# Altium schematic sheet MTCH9010_Evaluation_Kit_Power_USB_Bridge.SchDoc
size A3; SheetTitle: USB Bridge and Power Supply; CompanyName: Microchip Technology Inc.; Organization: Microchip Technology; Address1: 2355 West Chandler Blvd.; Address2: Chandler, AZ  85224; Address4: USA; SheetNumber: 3; SheetTotal: 4; Time: Time
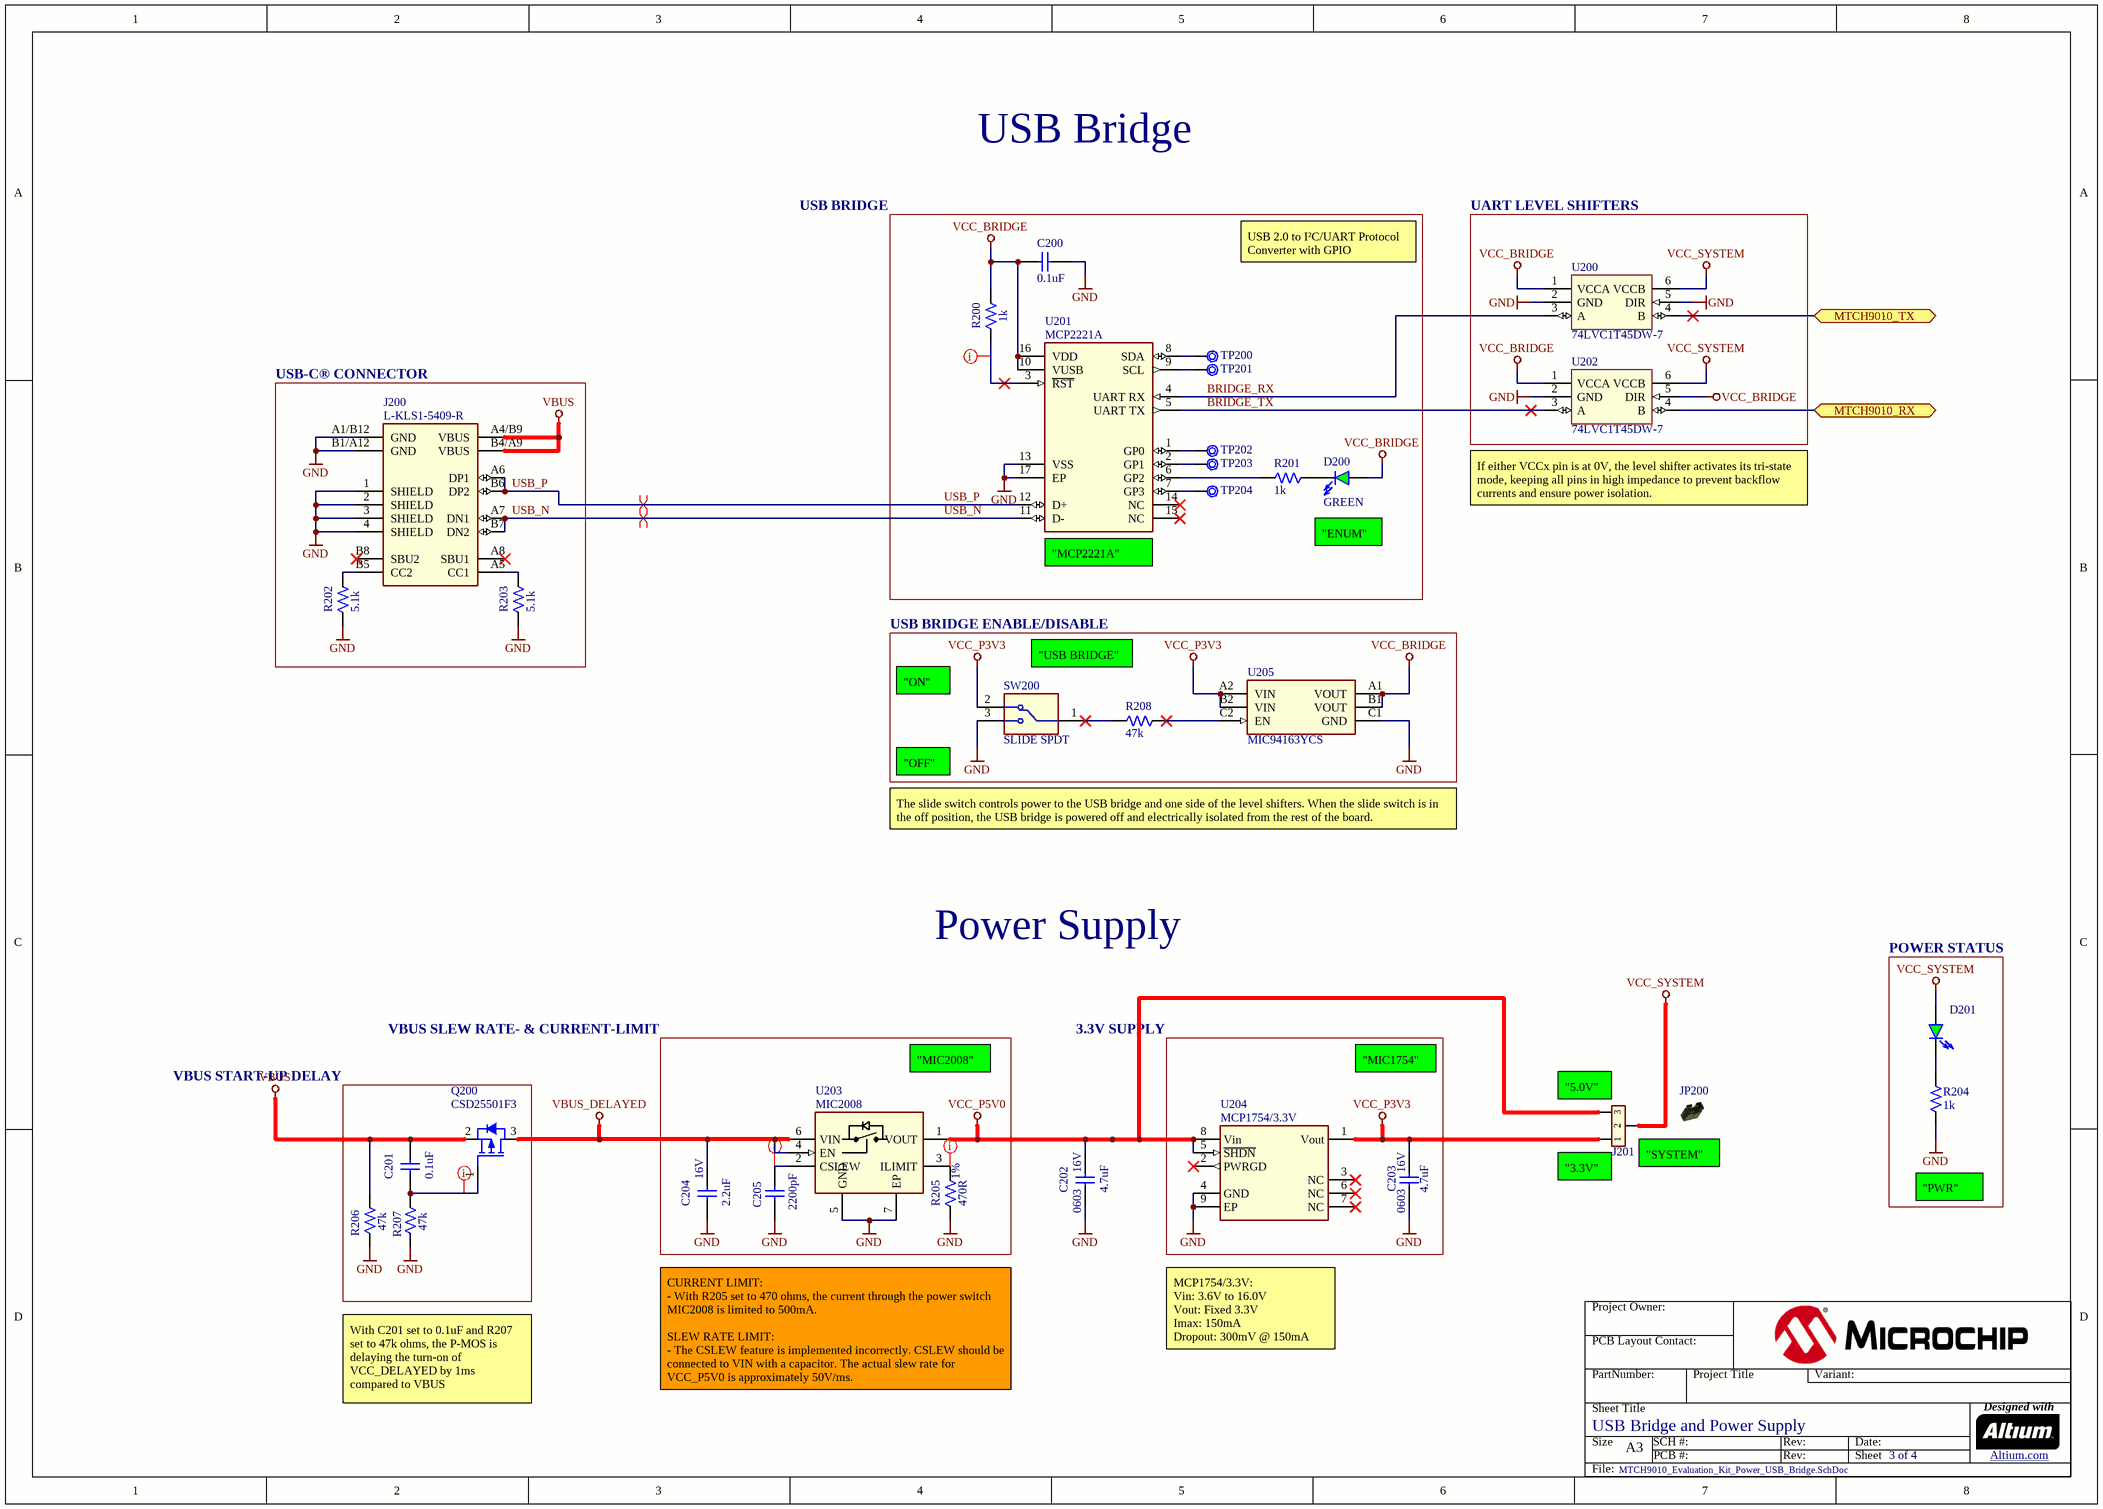
[diagram p0: MTCH9010_Evaluation_Kit_Power_USB_Bridge.SchDoc]

## Parts
C200  value 0.1uF  [CAP_C_0402]  (hidden comment: Capacitor NP)
C201  value 0.1uF  [CAP_C_0402]  (hidden comment: Capacitor NP)
C202  value 4.7uF  Voltage: 16V  Package: 0603  [CAP_C_0603]  (hidden comment: Capacitor NP)
C203  value 4.7uF  Voltage: 16V  Package: 0603  [CAP_C_0603]  (hidden comment: Capacitor NP)
C204  value 2.2uF  Voltage: 16V  [CAP_C_0402]  (hidden comment: Capacitor NP)
C205  value 2200pF  [CAP_C_0402]  (hidden comment: Capacitor NP)
D200  value GREEN  [LED_0603_Green]  (hidden comment: LED_green)
D201  LED_green  [LED_0603_Green]  (value not drawn)
J200  Manufacturer Part Number 1: L-KLS1-5409-R  [CON_USB2.0-C_RCPT_SMD_RA_KLS_KLS1-5409]  (hidden comment: CON USB2.0-C RCPT SMD RA KLS KLS1-5409)
J201  Header 1x3  [HDR_M_2.54_1X2_U_TH-PIP_RA_WCON_1125-1103S0R140CR01]  (value not drawn)
JP200  Jumper Mechanical  [Jumper_Mechanical]  (value not drawn)
Q200  value CSD25501F3  [LGA-3_GSD_0.7x0.6_CSD25501F3]  (hidden comment: Transistor MOS-P GSD)
R200  value 1k  [RES_C_0402]  (hidden comment: Resistor)
R201  value 1k  [RES_C_0402]  (hidden comment: Resistor)
R202  value 5.1k  [RES_C_0402]  (hidden comment: Resistor)
R203  value 5.1k  [RES_C_0402]  (hidden comment: Resistor)
R204  value 1k  [RES_C_0402]  (hidden comment: Resistor)
R205  value 470R  Tolerance: 1%  [RES_C_0402]  (hidden comment: Resistor)
R206  value 47k  [RES_C_0402]  (hidden comment: Resistor)
R207  value 47k  [RES_C_0402]  (hidden comment: Resistor)
R208  value 47k  [RES_C_0402]  (hidden comment: Resistor)
SW200  value SLIDE SPDT  [SW_SLIDE_SMD_SS_SLW-88229-2-SMT-TR]  (hidden comment: SWITCH SLIDE SMD SPDT SLW-88229-2-SMT-TR)
TP200  Test Point No BOM  [CON_TP_0.8dia_SMD_with_Test_Jig_Layer]  (value not drawn)  (no BOM)
TP201  Test Point No BOM  [CON_TP_0.8dia_SMD_with_Test_Jig_Layer]  (value not drawn)  (no BOM)
TP202  Test Point No BOM  [CON_TP_0.8dia_SMD_with_Test_Jig_Layer]  (value not drawn)  (no BOM)
TP203  Test Point No BOM  [CON_TP_0.8dia_SMD_with_Test_Jig_Layer]  (value not drawn)  (no BOM)
TP204  Test Point No BOM  [CON_TP_0.8dia_SMD_with_Test_Jig_Layer]  (value not drawn)  (no BOM)
U200  value 74LVC1T45DW-7  [SOT-363]  (hidden comment: 74LVC(H)1T45 SOT-23-6_SC-70-6_SOT-6_SOT-363_DSBGA)
U201  value MCP2221A  [QFN-16_4X4_EP2.5X2.5]  (hidden comment: MCP2221 QFN-16)
U202  value 74LVC1T45DW-7  [SOT-363]  (hidden comment: 74LVC(H)1T45 SOT-23-6_SC-70-6_SOT-6_SOT-363_DSBGA)
U203  value MIC2008  [VDFN-6_2x2_EP0.8X1.40]  (hidden comment: MIC2008YML-TR VDFN-6)
U204  value MCP1754/3.3V  [DFN-8_2x3]  (hidden comment: MCP1755 DFN-8)
U205  value MIC94163YCS  [MIC94163_1.5MM_1MM]  (hidden comment: MIC94163_1.5MM_1MM)

## Blocks framed on the sheet
USB BRIDGE: C200 D200 R200 R201 TP200-TP204 U201
UART LEVEL SHIFTERS: U200 U202
USB-C® CONNECTOR: J200 R202 R203
USB BRIDGE ENABLE/DISABLE: R208 SW200 U205
POWER STATUS: D201 R204
VBUS SLEW RATE- & CURRENT-LIMIT: C204 C205 R205 U203
3.3V SUPPLY: C203 U204
VBUS START-UP DELAY: C201 Q200 R206 R207

## Ports
MTCH9010_RX (bidir), MTCH9010_TX (bidir)

## Nets
GND: C200.2 C202.1 C203.1 C204.1 C205.1 J200.1(SHIELD) J200.2(SHIELD) J200.3(SHIELD) J200.4(SHIELD) J200.A1/B12(GND) J200.B1/A12(GND) R202.2 R203.2 R204.1 R205.1 R206.2 R207.2 SW200.3 U200.2(GND) U200.5(DIR) U201.13(VSS) U201.17(EP) U202.2(GND) U203.5(GND) U203.7(EP) U204.4(GND) U204.9(EP) U205.C1(GND)
VBUS: C201.2 J200.A4/B9(VBUS) J200.B4/A9(VBUS) Q200.2(S) R206.1
VBUS_DELAYED: C204.2 Q200.3(D) U203.4(EN) U203.6(VIN)
VCC_BRIDGE: C200.1 D200.1(A) R200.2 U200.1(VCCA) U201.10(VUSB) U201.16(VDD) U202.1(VCCA) U202.5(DIR) U205.A1(VOUT) U205.B1(VOUT)
VCC_P3V3: C203.2 J201.1 SW200.2 U204.1(Vout) U205.A2(VIN) U205.B2(VIN)
VCC_P5V0: C202.2 J201.3 U203.1(VOUT) U204.5(~{SHDN}) U204.8(Vin)
VCC_SYSTEM: D201.1(A) J201.2 U200.6(VCCB) U202.6(VCCB)
BRIDGE_RX: U200.3(A) U201.4(UART_RX)
BRIDGE_TX: U201.5(UART_TX) U202.3(A)
MTCH9010_RX: U202.4(B) ; port MTCH9010_RX
MTCH9010_TX: U200.4(B) ; port MTCH9010_TX
USB_N: J200.A7(DN1) J200.B7(DN2) U201.11(D-)
USB_P: J200.A6(DP1) J200.B6(DP2) U201.12(D+)
NetC201_1: C201.1 Q200.1(G) R207.1
NetC205_2: C205.2 U203.2(CSLEW)
NetD200_2: D200.2(K) R201.1
NetD201_2: D201.2(K) R204.2
NetJ200_A5: J200.A5(CC1) R203.1
NetJ200_B5: J200.B5(CC2) R202.1
NetR200_1: R200.1 U201.3(~{RST})
NetR201_2: R201.2 U201.6(GP2)
NetR205_2: R205.2 U203.3(ILIMIT)
NetR208_1: R208.1 SW200.1
NetR208_2: R208.2 U205.C2(EN)
NetTP200_1: TP200.1 U201.8(SDA)
NetTP201_1: TP201.1 U201.9(SCL)
NetTP202_1: TP202.1 U201.1(GP0)
NetTP203_1: TP203.1 U201.2(GP1)
NetTP204_1: TP204.1 U201.7(GP3)

Not connected (* = marked no-connect by the designer): J200 A8(SBU1)* B8(SBU2)*; U201 14(NC)* 15(NC)*; U204 2(PWRGD)* 3(NC)* 6(NC)* 7(NC)*

## Layout directives
differential pair; net class NO TESTPOINT: USB_N, USB_P
net class NO TESTPOINT: NetC201_1, NetC205_2, NetR200_1, NetR205_2

## Notes on the sheet
- USB Bridge
- USB 2.0 to I²C/UART Protocol Converter with GPIO
- (near U202) If either VCCx pin is at 0V, the level shifter activates its tri-state mode, keeping all pins in high impedance to prevent backflow currents and ensure power isolation.
- (near U201) "MCP2221A"
- "ENUM"
- "ON"
- "USB BRIDGE"
- "OFF"
- The slide switch controls power to the USB bridge and one side of the level shifters. When the slide switch is in the off position, the USB bridge is powered off and electrically isolated from the rest of the board.
- Power Supply
- "MIC2008"
- "MIC1754"
- (near J201) "5.0V"
- (near J201) "3.3V"
- (near J201) "SYSTEM"
- "PWR"
- With C201 set to 0.1uF and R207 set to 47k ohms, the P-MOS is delaying the turn-on of VCC_DELAYED by 1ms compared to VBUS
- CURRENT LIMIT:
  - With R205 set to 470 ohms, the current through the power switch MIC2008 is limited to 500mA.
  SLEW RATE LIMIT:
  - The CSLEW feature is implemented incorrectly. CSLEW should be connected to VIN with a capacitor. The actual slew rate for VCC_P5V0 is approximately 50V/ms.
- MCP1754/3.3V:
  Vin: 3.6V to 16.0V
  Vout: Fixed 3.3V
  Imax: 150mA
  Dropout: 300mV @ 150mA
- Project Owner:
- PCB Layout Contact:
- PartNumber:
- Project Title
- Variant:
- Sheet Title
- Size
- A3
- SCH #:
- PCB #:
- Rev:
- Date:
- Sheet
- Designed with
- Altium.com <http://go.altium.com/MicrochipLandingPage_Evaluation.html>
- File:

## Library data of the parts
C200 C201 = CAP1033: Manufacturer 1: KEMET; Manufacturer Part Number 1: C0402C104K4RAC7867; Voltage: 16V; Description_: CAP CER 0.1uF 16V 10% X7R SMD 0402; Tolerance: 10%; Type: Ceramic; Populated: Yes; Temperature Coefficient: X7R; MCHP-ID: CAP1033; Package: 0402; Revision: 11; Symbol: Capacitor NP; Operating Temperature: -55C to +125C; Category: Capacitor; Manufacturer 2: Samsung Electro-Mechanics; Manufacturer Part Number 2: CL05B104KO5NNNC; Supplier 1: Digi-Key; Supplier Part Number 1: 399-C0402C104K4RAC7867TR-ND; Supplier 2: Digi-Key; Supplier Part Number 2: 1276-1001-1-ND; Manufacturer 3: Würth Elektronik; Manufacturer Part Number 3: 885012205037; Supplier 3: Digi-Key; Supplier Part Number 3: 732-7532-1-ND; Manufacturer 4: Samsung Electro-Mechanics; Manufacturer Part Number 4: CL05B104KO5NNND; Manufacturer 5: Samsung Electro-Mechanics; Manufacturer Part Number 5: CL05B104KO5NNNO; Manufacturer 6: Yageo; Manufacturer Part Number 6: CC0402KRX7R7BB104; Supplier 4: Mouser; Supplier Part Number 4: 187-CL05B104KO5NNND; Supplier 5: Samsung Electro-Mechanics; Supplier Part Number 5: CL05B104KO5NNNO; Supplier 6: Yageo; Supplier Part Number 6: CC0402KRX7R7BB104
C202 C203 = CAP1288: Manufacturer 1: TDK Corporation; Manufacturer Part Number 1: C1608X5R1C475K080AC; Description_: CAP CER 4.7uF 16V 10% X5R SMD 0603; Tolerance: 10%; Temperature Coefficient: X5R; Type: Ceramic; Populated: YES; MCHP-ID: CAP1288; Revision: 1; Symbol: Capacitor NP; Operating Temperature: -55C to +85C; Category: Capacitor; Supplier 1: Digi-Key; Supplier Part Number 1: 445-7478-1-ND
C204 = CAP1765: Manufacturer 1: Murata; Manufacturer Part Number 1: GRM155R61C225KE44D; Description_: CAP CER 2.2uF 16V 10% X5R SMD 0402; Tolerance: 10%; Temperature Coefficient: X5R; Type: Ceramic; Populated: YES; MCHP-ID: CAP1765; Package: 0402; Revision: 2; Symbol: Capacitor NP; Operating Temperature: -55°C ~ 85°C; Category: Capacitor; Manufacturer 2: TDK Corporation; Manufacturer Part Number 2: C1005X5R1C225K050BC; Supplier 1: Digi-Key; Supplier Part Number 1: 490-10455-2-ND; Supplier 2: Digi-Key; Supplier Part Number 2: 445-9085-1-ND
C205 = CAP1265: Manufacturer 1: KEMET; Manufacturer Part Number 1: C0402C222J3GACTU; Voltage: 25V; Description_: CAP CER 2200pF 25V 5% C0G SMD 0402; Tolerance: 5%; Type: Ceramic; Populated: YES; Temperature Coefficient: C0G; MCHP-ID: CAP1265; Package: 0402; Revision: 1; Symbol: Capacitor NP; Operating Temperature: -55C to +125C; Category: Capacitor; Supplier 1: Digi-Key; Supplier Part Number 1: 399-8957-1-ND
D200 = DIODE1945: LED; Manufacturer 1: Luckylight; Manufacturer Part Number 1: S192GC-1BG; Description_: DIO LED GREEN 2V 25mA 40mcd CLEAR SMD 0603; Type: LED Single; Forward Current: 25mA; Power: 60mW; Reverse Current: 10uA; Reverse Voltage: 5V; Populated: YES; MCHP-ID: DIODE1945; Revision: 1; Symbol: LED_green; Package: 0603; Operating Temperature: -40C to +80C; Category: Diode; Supplier 1: Cabcon A/S; Supplier Part Number 1: S192GC-1BG
D201 = DIODE1945: LED; Manufacturer 1: Luckylight; Manufacturer Part Number 1: S192GC-1BG; Value: GREEN; Description_: DIO LED GREEN 2V 25mA 40mcd CLEAR SMD 0603; Type: LED Single; Forward Current: 25mA; Populated: YES; Power: 60mW; Reverse Current: 10uA; Reverse Voltage: 5V; Revision: 1; Symbol: LED_green; Package: 0603; Category: Diode; Supplier 1: Cabcon A/S; Supplier Part Number 1: S192GC-1BG; Operating Temperature: -40C to +80C; MCHP-ID: DIODE1945
J200 = CON2580: Manufacturer 1: KLS Electronic; Value: USB2.0 Type-C FEMALE; Description_: CON USB2.0 Type-C Female SMD R/A; Voltage: 100V AC; Current: 5A; Populated: YES; MCHP-ID: CON2580; Revision: 2; Symbol: CON USB2.0-C RCPT SMD RA KLS KLS1-5409; Type: USB; Category: Connector; Supplier 1: Cabcon A/S; Supplier Part Number 1: L-KLS1-5409-R; Operating Temperature: -30C to +85C; Assembly Type: SMD
J201 = CON3019: Manufacturer 1: WCON; Manufacturer Part Number 1: 1125-1103S0R140CR01; Value: HDR-2.54 Male 1x3; Description_: CON HDR-2.54 MALE 1x3 GOLD FLASH/TIN 6.00MH TH-PIP R/A; Voltage: 1kV; Current: 3A; Populated: YES; MCHP-ID: CON3019; Revision: 1; Symbol: Header 1x3; Type: Header 2.54mm; Category: Connector; Supplier 1: Cabcon A/S; Supplier Part Number 1: 1125-1103S0R140CR01; Operating Temperature: -40°C to +105°C; Assembly Type: TH PIP
JP200 = MECH0482: Manufacturer 1: WCON; Manufacturer Part Number 1: 3710-6001OS0B01; Value: JUMPER 2.54mm 1x2; Description_: MECH HW JUMPER 2.54mm 1x2 Black; Populated: MECH; MCHP-ID: MECH0482; Revision: 2; Symbol: Jumper Mechanical; Type: Jumper; Category: Hardware; Supplier 1: Cabcon A/S; Supplier Part Number 1: 3710-6001OS0B01; Operating Temperature: -40C to +105C
Q200 = TRA1611: Transistor MOS; Manufacturer 1: Texas Instruments; Description_: TRANS FET P-CH CSD25501F3 -20V -3.6A 0.076R LGA; Type: FET; Current: -3.6A; Drain to Source Voltage: -20V; Populated: YES; MCHP-ID: TRA1611; Revision: 1; Symbol: Transistor MOS-P GSD; Package: LGA; Operating Temperature: -55C to +150C; Category: Transistor; Gate to Source Voltage: -20V; Voltage: -20V; Manufacturer Part Number 1: CSD25501F3; Manufacturer 2: Texas Instruments; Manufacturer Part Number 2: CSD25501F3T; Supplier 1: Digi-Key; Supplier Part Number 1: 296-51017-2-ND; Supplier 2: Digi-Key; Supplier Part Number 2: 296-47556-2-ND
R200 R201 R204 = RES1022: Manufacturer 1: Panasonic; Manufacturer Part Number 1: ERJ-2RKF1001X; Tolerance: 1%; Description_: RES TKF 1k 1% 1/10W SMD 0402; Voltage: 50V; Power: 1/10W; Populated: YES; Temperature Coefficient: 100ppm/C; MCHP-ID: RES1022; Package: 0402; Revision: 3; Symbol: Resistor; Operating Temperature: -55C to +155C; Category: Resistor; Type: RES SMD; Composition: TKF; Supplier 1: Digi-Key; Supplier Part Number 1: P1.00KLTR-ND
R202 R203 = RES1655: Manufacturer 1: Panasonic Electronic Components; Manufacturer Part Number 1: ERJ-2RKF5101X; Tolerance: 1%; Description_: RES TKF 5.1k 1% 1/10W SMD 0402; Temperature Coefficient: 100ppm/C; Power: 1/10W; Populated: YES; MCHP-ID: RES1655; Package: 0402; Revision: 1; Symbol: Resistor; Operating Temperature: -55C to +155C; Category: Resistor; Type: RES SMD; Composition: TKF; Supplier 1: Digi-Key; Supplier Part Number 1: P5.10KLCT-ND
R205 = RSMT1163: Manufacturer 1: Yageo; Manufacturer Part Number 1: RC0402FR-07470RL; Description_: RES TKF 470R 1% 1/16W MF 0402; Populated: YES; MCHP-ID: RSMT1163; Package: 0402; Revision: 2; Symbol: resistor; Category: Resistor; Type: RES SMD; Supplier 1: Digi-Key; Supplier Part Number 1: 311-470LRCT-ND
R206-R208 = RES2662: Manufacturer 1: Yageo; Manufacturer Part Number 1: RC0402FR-0747KL; Tolerance: 1%; Description_: RES TKF 47k 1% 1/16W SMD 0402; Voltage: 50V; Populated: YES; MCHP-ID: RES2662; Package: 0402; Revision: 3; Symbol: Resistor; Category: Resistor; Type: RES SMD; Composition: TKF; Supplier 1: Digi-Key; Supplier Part Number 1: 311-47.0KLRCT-ND
SW200 = SWITCH1238: Manufacturer 1: Same Sky; Description_: SWITCH SLIDE SPDT 12V 100mA SLW-88229-2-SMT-TR SMD; Voltage: 12V; Current: 100mA; Populated: YES; MCHP-ID: SWITCH1238; Revision: 1; Symbol: SWITCH SLIDE SMD SPDT SLW-88229-2-SMT-TR; Category: Switch; Type: Slide; Manufacturer Part Number 1: SLW-88229-2-SMT-TR; Supplier 1: Digi-Key; Supplier Part Number 1: 2223-SLW-88229-2-SMT-TR-ND; Operating Temperature: -20C to +70C
TP200-TP204 = CON2120: Test Point; Value: TP SMD D0.8; Description_: CON TP PAD PCB SMD D0.8; Populated: DNP; MCHP-ID: CON2120; Revision: 1; Symbol: Test Point No BOM; Type: Test Point No BOM; Category: Connector; Assembly Type: SMD
U200 U202 = IC2714: Manufacturer 1: Diodes Incorporated; MCHP-ID: IC2714; Description_: IC TRANSCEIVER 74LVC1T45DW-7 Single Bit Bidirectional Voltage Translator SOT-363; Populated: YES; Revision: 1; Symbol: 74LVC(H)1T45 SOT-23-6_SC-70-6_SOT-6_SOT-363_DSBGA; Package: SOT-363; Operating Temperature: -40C to +125C; Type: Transceiver; Category: IC; Manufacturer Part Number 1: 74LVC1T45DW-7; Supplier 1: Digi-Key; Supplier Part Number 1: 31-74LVC1T45DW-7TR-ND
U201 = MIC6971: Manufacturer 1: Microchip Technology; Manufacturer Part Number 1: MCP2221A-I/ML; Description_: MCHP INTERFACE USB I2C/UART MCP2221A-I/ML QFN-16; Populated: YES; MCHP-ID: MIC6971; Symbol: MCP2221 QFN-16; Type: USB; Revision: 3; Category: MCHP-Interface; Manufacturer 2: Microchip Technology; Manufacturer Part Number 2: MCP2221AT-I/ML; Supplier 1: Digi-Key; Supplier Part Number 1: MCP2221A-I/ML-ND; Supplier 2: Microchip Technology; Supplier Part Number 2: MCP2221AT-I/ML; Operating Temperature: -40C to +85C
U203 = MIC9604: Manufacturer 1: Microchip Technology; Description_: MCHP ANALOG POWER SWITCH 5.5V 2.1A MIC2008YML-TR VDFN-6; Populated: YES; MCHP-ID: MIC9604; Symbol: MIC2008YML-TR VDFN-6; Type: Power Switch; Revision: 1; Category: MCHP-Analog; Manufacturer Part Number 1: MIC2008YML-TR; Supplier 1: Digi-Key; Supplier Part Number 1: 576-2591-2-ND; Operating Temperature: -40C to +85C; Supplier 2: Microchip Technology; Supplier Part Number 2: MIC2008YML-TR
U204 = MIC7482: Manufacturer 1: Microchip Technology; Manufacturer Part Number 1: MCP1754T-3302E/MC; Description_: MCHP ANALOG LDO 3.3V MCP1754T-3302E/MC DFN-8; Populated: YES; MCHP-ID: MIC7482; Symbol: MCP1755 DFN-8; Type: LDO; Revision: 3; Category: MCHP-Analog; Supplier 1: Digi-Key; Supplier Part Number 1: MCP1754T-3302E/MC-ND; Operating Temperature: -40C to +125C; Manufacturer 2: Microchip Technology; Manufacturer Part Number 2: MCP1754-3302E/MC; Supplier 2: Microchip Technology; Supplier Part Number 2: MCP1754-3302E/MC
U205 = MIC8744: Manufacturer 1: Microchip Technology; Manufacturer Part Number 1: MIC94163YCS-TR; Description_: IC LOAD SWITCH HI SIDE 3A 6WLCSP; Populated: YES; MCHP-ID: MIC8744; Symbol: MIC94163_1.5MM_1MM; Type: Power Switch; Revision: 1; Category: MCHP-Analog; Supplier 1: Digi-Key; Supplier Part Number 1: 576-4454-2-ND; Operating Temperature: -40C to +125C